# EAGLE design mLamp (EAGLE 7.2.0)
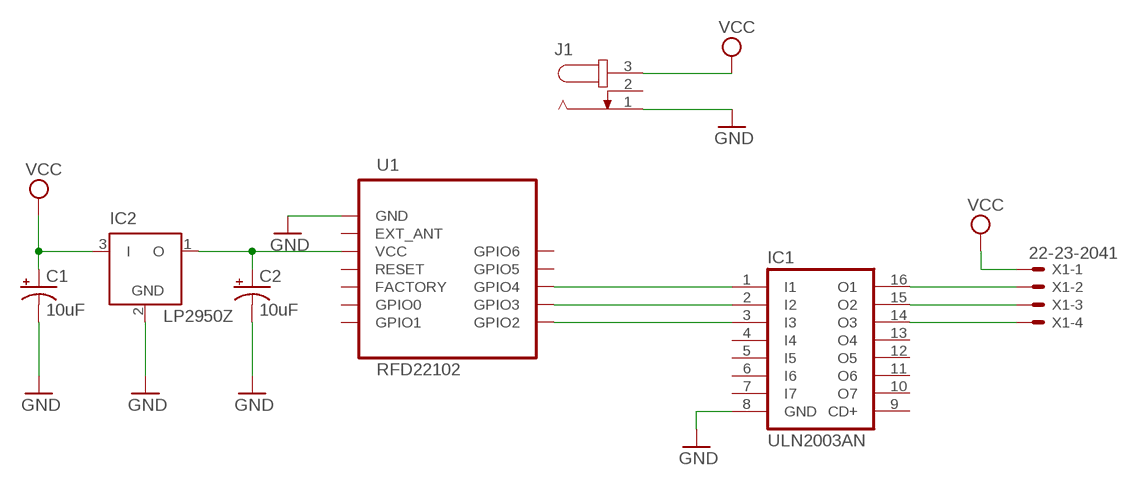
[diagram p0: schematic, sheet 1]

## Parts
C1  10uF  CAP_POLPTH2  [CPOL-RADIAL-10UF-25V]
C2  10uF  CAP_POLPTH2  [CPOL-RADIAL-10UF-25V]
IC1  ULN2003AN  [DIL16]
IC2  LP2950Z  [TO92]
J1  JACK-PLUG0  [SPC4077]
U1  RFD22102  [RFD22102]
X1  22-23-2041  [22-23-2041]

## Nets
GND: C1.2(-) C2.2(-) IC1.8(GND) IC2.2(GND) J1.1 U1.GND
N$1: IC1.2(I2) U1.GPIO3
N$2: IC1.1(I1) U1.GPIO4
N$3: IC1.3(I3) U1.GPIO2
N$4: C2.1(+) IC2.1(O) U1.VCC
N$5: IC1.14(O3) X1.4
N$6: IC1.15(O2) X1.3
N$7: IC1.16(O1) X1.2
VCC: C1.1(+) IC2.3(I) J1.3 X1.1
Unconnected: IC1.4(I4) IC1.5(I5) IC1.6(I6) IC1.7(I7) IC1.9(CD+) IC1.10(O7) IC1.11(O6) IC1.12(O5) IC1.13(O4) J1.2 U1.EXT_ANT U1.FACTORY U1.GPIO0 U1.GPIO1 U1.GPIO5 U1.GPIO6 U1.RESET

## Library data of the parts
C1 C2 = SparkFun-Capacitors:CAP_POL: Capacitor Polarized These are standard SMD and PTH capacitors. Normally 10uF, 47uF, and 100uF in electrolytic and tantalum varieties. Always verify the external diameter of the through hole cap, it varies with capacity, voltage, and manufacturer. The EIA devices should be standard.
IC1 = uln-udn:ULN2003A: DRIVER ARRAY
IC2 = linear:LP2950: 100 mA, Low Power Low Dropout Voltage Regulator Source: http://www.onsemi.com/pub/Collateral/LP2950-D.PDF
J1 = con-jack:JACK-PLUG: DC POWER JACK Power Jack, DC, Right Angle, Through Hole, Rated 5A at 16VDC, PC Terminals Distributor: Farnell (www.Farnell.de) Drawing: 84N1161.pdf / 84N1162.pdf Manufacturer: SPC Technology (www.spctechnology.com) Type: SPC4077 / SPC 4078; OC_FARNELL: unknown; OC_NEWARK: unknown
U1 = RF_Digital_RFD22102_Eagle_Schematic_PCB_Library:RFD22102: RFD22102 RFduino DIP module RFduino Datasheet: http://www.rfdigital.com/wp-content/uploads/2014/03/rfduino.datasheet.pdf
X1 = con-molex:22-23-2041: .100" (2.54mm) Center Header - 4 Pin; MF: MOLEX; MPN: 22-23-2041; OC_FARNELL: 1462920; OC_NEWARK: 38C0355

## Board
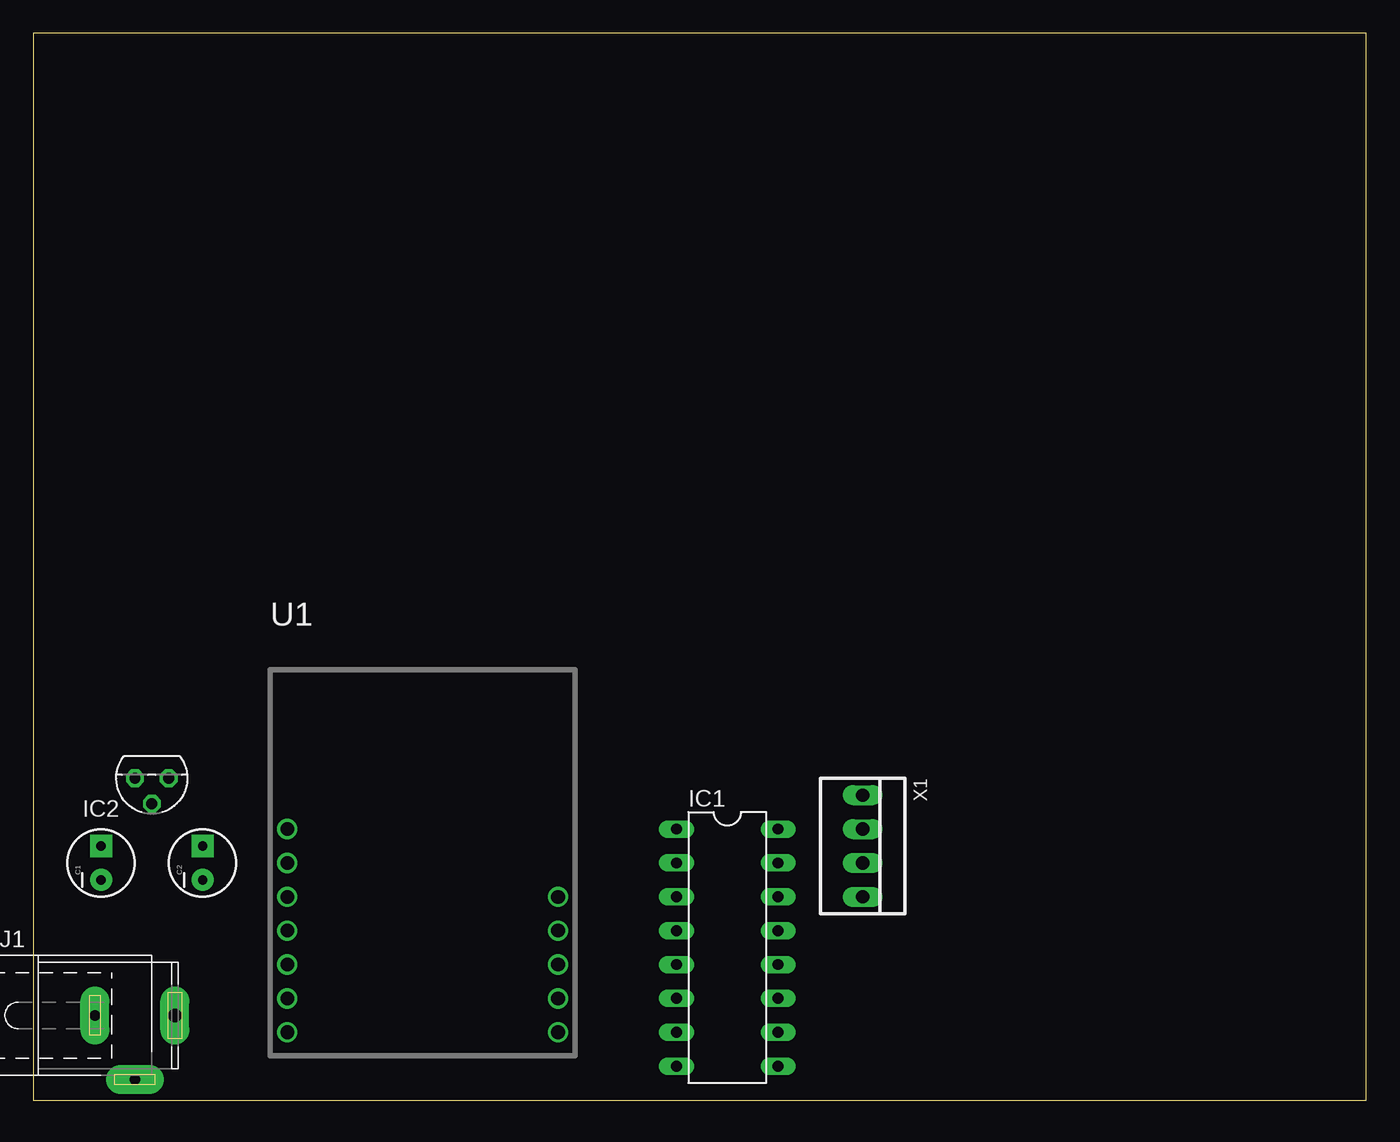
[diagram p1: board, top side]
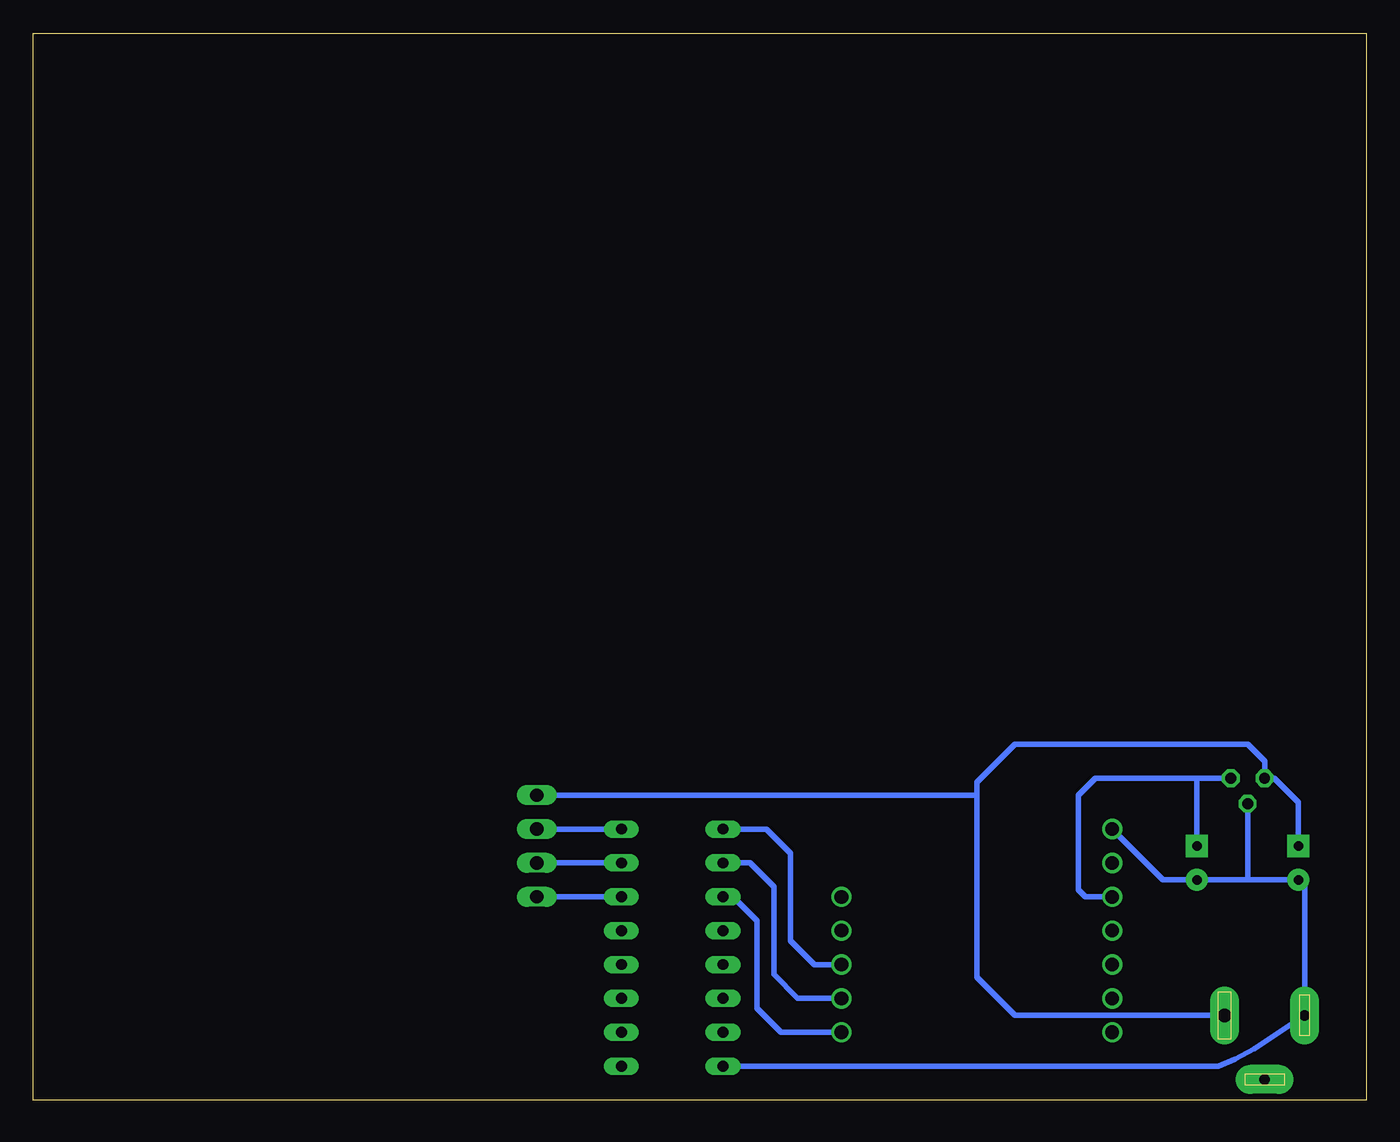
[diagram p2: board, bottom side, seen from below]

Size 100 x 80 mm. Coordinates in mm from the lower left corner, seen from the top.
Outline: 0,0 100,0 100,80 0,80 0,0
Copper layers (1*16): Top 0.035mm / dielectric 1.5mm / Bottom 0.035mm
Design rules "default": minimum track width 10mil, minimum drill 24mil, track to track 8mil, track to pad 8mil, pad to pad 8mil, via to via 8mil, smd to smd 8mil, copper to edge 40mil, drill to drill 8mil, minimum pad ring 10mil, minimum via ring 8mil, stop-mask expansion 4mil, vias tented up to drill 0mil, thermal gap 10mil

### Footprints (pad centres in the part's own frame; a part is rotated, then mirrored left to right if it is on the bottom)
CPOL-RADIAL-10UF-25V = drill 0.7 pad 1.651 square: 1 1.27,0 | drill 0.7 pad 1.651: 2 -1.27,0
DIL16 = drill 0.813 long: 1 -8.89,-3.81; 2 -6.35,-3.81; 3 -3.81,-3.81; 4 -1.27,-3.81; 5 1.27,-3.81; 6 3.81,-3.81; 7 6.35,-3.81; 8 8.89,-3.81; 9 8.89,3.81; 10 6.35,3.81; 11 3.81,3.81; 12 1.27,3.81; 13 -1.27,3.81; 14 -3.81,3.81; 15 -6.35,3.81; 16 -8.89,3.81
TO92 = drill 0.813 octagon: 1 -1.27,0; 2 0,1.905; 3 1.27,0
SPC4077 = drill 0.8 pad 2.184 long: 1 -3,0; 2 0,-4.8 | drill 1 pad 2.184 long: 3 3,0
RFD22102 = drill 1.016: EXT_ANT -10.16,0; FACTORY -10.16,-7.62; GND -10.16,2.54; GPIO0 -10.16,-10.16; GPIO1 -10.16,-12.7; GPIO2 10.16,-12.7; GPIO3 10.16,-10.16; GPIO4 10.16,-7.62; GPIO5 10.16,-5.08; GPIO6 10.16,-2.54; RESET -10.16,-5.08; VCC -10.16,-2.54
22-23-2041 = drill 1 long: 1 -3.81,0; 2 -1.27,0; 3 1.27,0; 4 3.81,0

### Placement (x,y rotation side)
C1  5.08,17.78 90 top
C2  12.7,17.78 90 top
IC1  52.07,11.43 270 top
IC2  8.89,24.13 180 top
J1  7.62,6.35 0 top
U1  29.21,17.78 0 top
X1  62.23,19.05 270 top

### Tracks (layer width: path | path; a pad name or v marks a point on that pad's centre or on a via)
GND
  Bottom 0.406: 8.89,16.51 C2.2 15.24,16.51 U1.GND | 8.89,16.51 C1.2 4.62,16.51 J1.1 8.4,3.83 9.85,3.05 11.08,2.54 IC1.8 | IC2.2 8.89,16.51
N$1
  Bottom 0.406: U1.GPIO3 42.65,7.62 44.45,9.42 44.45,15.98 46.25,17.78 IC1.2
N$2
  Bottom 0.406: U1.GPIO4 41.38,10.16 43.18,11.96 43.18,18.52 44.98,20.32 IC1.1
N$3
  Bottom 0.406: U1.GPIO2 43.92,5.08 45.72,6.88 45.72,13.44 47.52,15.24 IC1.3
N$4
  Bottom 0.406: IC2.1 12.7,24.13 | 12.7,24.13 20.32,24.13 21.59,22.86 21.59,15.77 21.06,15.24 U1.VCC | C2.1 12.7,24.13
N$5
  Bottom 0.406: IC1.14 X1.4
N$6
  Bottom 0.406: IC1.15 X1.3
N$7
  Bottom 0.406: IC1.16 X1.2
VCC
  Bottom 0.406: 10.16,6.35 J1.3 26.37,6.35 29.21,9.19 29.21,22.86 | X1.1 29.21,22.86 | 29.21,22.86 29.21,23.83 26.37,26.67 8.89,26.67 7.62,25.4 IC2.3 6.88,24.13 5.08,22.33 C1.1